# Altium schematic sheet Teensy4-CANTool-Rev3.SchDoc: Teensy 4.1 CAN Tool
size Letter portrait; Author: Dr. Jeremy Daily; Organization: Systems Cyber Research Group; Address1: Systems Engineering; Address2: Colorado State University; Address3: Fort Collins, CO 80523; Address4: www.engr.colostate.edu/se/; DocumentNumber: Vehicle Communications; Revision: 3; SheetNumber: 1; SheetTotal: 1
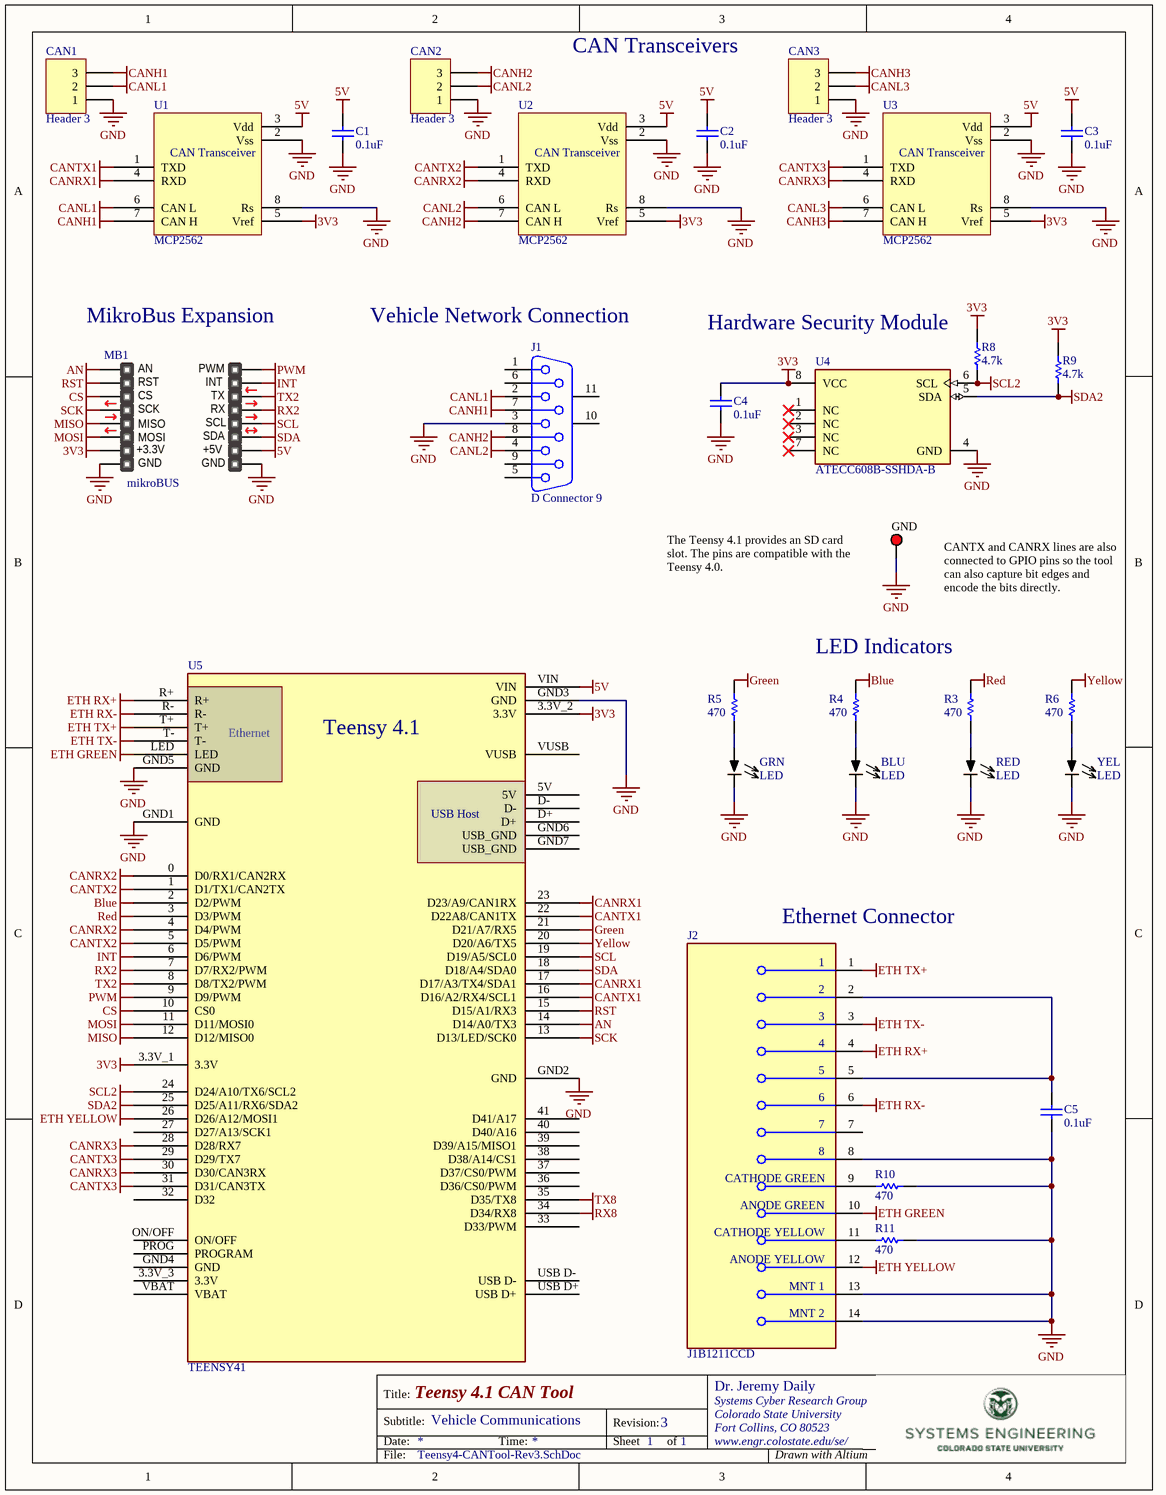
[diagram p0: Teensy4-CANTool-Rev3.SchDoc]

## Parts
BLU  LED  [LED - 5mm Through Hole]
C1  0.1uF  [CAPR5-4X5]
C2  0.1uF  [CAPR5-4X5]
C3  0.1uF  [CAPR5-4X5]
C4  0.1uF  [CAPR5-4X5]
C5  0.1uF  [CAPR5-4X5]
CAN1  Header 3  [PCB Terminal Block - 3]
CAN2  Header 3  [PCB Terminal Block - 3]
CAN3  Header 3  [PCB Terminal Block - 3]
GND  5010  [KSTN-5010_V]  (value not drawn)
GRN  LED  [LED - 5mm Through Hole]
J1  D Connector 9  [DSUB1.385-2H9]
J2  J1B1211CCD  [FP-J1B1211CCD-MFG]
MB1  mikroBUS  [mikroBUS - Midi]  (no BOM)
R3  470  [AXIAL-0.4]
R4  470  [AXIAL-0.4]
R5  470  [AXIAL-0.4]
R6  470  [AXIAL-0.4]
R8  4.7k  [RESA60-630X240]
R9  4.7k  [RESA60-630X240]
R10  470  [AXIAL-0.4]
R11  470  [axial-0.4]
RED  LED  [LED - 5mm Through Hole]
U1  MCP2562  [DIP8]
U2  MCP2562  [DIP8]
U3  MCP2562  [DIP8]
U4  ATECC608B-SSHDA-B  [FP-C04-057-SWB-IPC_C]
U5  TEENSY41  [MODULE_DEV-16771]
YEL  LED  [LED - 5mm Through Hole]

## Nets
3V3: C4.2 MB1.7(3.3V) R8.2 R9.2 U1.5(Vref) U2.5(Vref) U3.5(Vref) U4.8(VCC) U5.3.3V_1(3.3V) U5.3.3V_2(3.3V)
5V: C1.2 C2.2 C3.2 MB1.10(5V) U1.3(Vdd) U2.3(Vdd) U3.3(Vdd) U5.VIN
AN: MB1.1(AN) U5.14(D14/A0/TX3)
Blue: R4.2 U5.2(D2/PWM)
CANH1: CAN1.3 J1.7 U1.7(CAN_H)
CANH2: CAN2.3 J1.8 U2.7(CAN_H)
CANH3: CAN3.3 U3.7(CAN_H)
CANL1: CAN1.2 J1.2 U1.6(CAN_L)
CANL2: CAN2.2 J1.4 U2.6(CAN_L)
CANL3: CAN3.2 U3.6(CAN_L)
CANRX1: U1.4(RXD) U5.17(D17/A3/TX4/SDA1) U5.23(D23/A9/CAN1RX)
CANRX2: U2.4(RXD) U5.0(D0/RX1/CAN2RX) U5.4(D4/PWM)
CANRX3: U3.4(RXD) U5.28(D28/RX7) U5.30(D30/CAN3RX)
CANTX1: U1.1(TXD) U5.16(D16/A2/RX4/SCL1) U5.22(D22A8/CAN1TX)
CANTX2: U2.1(TXD) U5.1(D1/TX1/CAN2TX) U5.5(D5/PWM)
CANTX3: U3.1(TXD) U5.29(D29/TX7) U5.31(D31/CAN3TX)
CS: MB1.3(CS) U5.10(CS0)
ETH GREEN: J2.10(ANODE_GREEN) U5.LED
ETH RX+: J2.4 U5.R+
ETH RX-: J2.6 U5.R-
ETH TX+: J2.1 U5.T+
ETH TX-: J2.3 U5.T-
ETH YELLOW: J2.12(ANODE_YELLOW) U5.26(D26/A12/MOSI1)
GND: BLU.2(C) C1.1 C2.1 C3.1 C4.1 C5.1 CAN1.1 CAN2.1 CAN3.1 GND.1 GRN.2(C) J1.3 J2.8 J2.13(MNT_1) J2.14(MNT_2) MB1.8(GND) MB1.9(GND) R10.1 R11.1 RED.2(C) U1.2(Vss) U1.8(Rs) U2.2(Vss) U2.8(Rs) U3.2(Vss) U3.8(Rs) U4.4(GND) U5.GND1(GND) U5.GND2(GND) U5.GND3(GND) U5.GND5(GND) YEL.2(C)
Green: R5.2 U5.21(D21/A7/RX5)
INT: MB1.15(INT) U5.6(D6/PWM)
MISO: MB1.5(MISO) U5.12(D12/MISO0)
MOSI: MB1.6(MOSI) U5.11(D11/MOSI0)
PWM: MB1.16(PWM) U5.9(D9/PWM)
Red: R3.2 U5.3(D3/PWM)
RST: MB1.2(RST) U5.15(D15/A1/RX3)
RX2: MB1.13(TX) U5.7(D7/RX2/PWM)
RX8: U5.34(D34/RX8)
SCK: MB1.4(SCK) U5.13(D13/LED/SCK0)
SCL: MB1.12(SCL) U5.19(D19/A5/SCL0)
SCL2: R8.1 U4.6(SCL) U5.24(D24/A10/TX6/SCL2)
SDA: MB1.11(SDA) U5.18(D18/A4/SDA0)
SDA2: R9.1 U4.5(SDA) U5.25(D25/A11/RX6/SDA2)
TX2: MB1.14(RX) U5.8(D8/TX2/PWM)
TX8: U5.35(D35/TX8)
Yellow: R6.2 U5.20(D20/A6/TX5)
NetBLU_1: BLU.1(A) R4.1
NetC5_2: C5.2 J2.2 J2.5
NetGRN_1: GRN.1(A) R5.1
NetJ2_9: J2.9(CATHODE_GREEN) R10.2
NetJ2_11: J2.11(CATHODE_YELLOW) R11.2
NetR3_1: R3.1 RED.1(A)
NetR6_1: R6.1 YEL.1(A)

Not connected (* = marked no-connect by the designer): J1 1 5 6 9 10(MH1) 11(MH2); J2 7; U4 1(NC)* 2(NC)* 3(NC)* 7(NC)*; U5 3.3V_3(3.3V) 5V 27(D27/A13/SCK1) 32(D32) 33(D33/PWM) 36(D36/CS0/PWM) 37(D37/CS0/PWM) 38(D38/A14/CS1) 39(D39/A15/MISO1) 40(D40/A16) 41(D41/A17) D+ D- GND4(GND) GND6(USB_GND) GND7(USB_GND) ON/OFF PROG(PROGRAM) USB D+ USB D- VBAT VUSB

## Notes on the sheet
- CAN Transceivers
- (near MB1) MikroBus Expansion
- (near J1) Vehicle Network Connection
- (near R8) Hardware Security Module
- (near GND) The Teensy 4.1 provides an SD card slot. The pins are compatible with the Teensy 4.0.
- (near GND) CANTX and CANRX lines are also connected to GPIO pins so the tool can also capture bit edges and encode the bits directly.
- LED Indicators
- (near J2) Ethernet Connector
- Title:
- Subtitle:
- Date:
- Time:
- Revision:
- Sheet
- of
- File:
- Drawn with Altium
- (in symbol CMP-105-000000-6) Ethernet; USB Host
- (in symbol MCP2551) CAN Transceiver
- (in symbol mikroBUS compatible add-on board) +3.3V; +5V

## Library data of the parts
BLU = LED: Blue 470nm LED Indication - Discrete 3.2V Radial; Manufacturer: Würth Elektronik; PartNumber: 151051BS04000; Supplier 1: Digi-Key; Supplier Part Number 1: 732-5015-ND
C1-C5 = Cap: 0.1µF ±10% 50V Ceramic Capacitor X7R 0603 (1608 Metric); Manufacturer: Vishay Beyschlag/Draloric/BC Components; PartNumber: K104K15X7RF53H5; Supplier 1: Digi-Key; Supplier Part Number 1: BC3323-ND
CAN1-CAN3 = Header 3: Header, 3-Pin; Manufacturer: Phoenix Contact; PartNumber: 1935174; Supplier 1: Digikey; Supplier Part Number 1: 277-1578-ND; Supplier 2: Digikey; Supplier Part Number 2: 1849-1099-ND
GND = CMP-002-00086-1: Interconnection Device; Connector Type: Interconnection Device; RoHS Compliant: Yes
GRN = LED: Green 572nm LED Indication - Discrete 2.1V Radial; Manufacturer: Würth Elektronik; PartNumber: 151051VS04000; Supplier 1: Digi-Key; Supplier Part Number 1: 732-5017-ND
J1 = D Connector 9: CONN D-SUB PLUG 9POS R/A SLDR; Manufacturer: Assmann WSW Components; PartNumber: A-DS 09 A/KG-T2S; Supplier 1: Digi-Key; Supplier Part Number 1: AE10968-ND
J2 = CMP-240752-000001-1: CONN JACK 1PORT 100 BASE-T PCB; Number of Cores per Jack: 4; Direction: Down; Connector Type: RJ45; Shielding: Shielded; Number of Ports: 1; Termination: Solder; Packaging: Bulk; Contact Material: Brass; Color: Green; Number of Rows: 1; Mount: Through Hole; Series: -; Contact Plating: Gold; Max Operating Temperature: 85°C; Min Operating Temperature: -40°C; Housing Material: Thermoplastic
MB1 = mikroBUS compatible add-on board
R3-R6 R10 R11 = Res1: 470 Ohms ±5% 0.25W, 1/4W Through Hole Resistor Axial Carbon Film; Manufacturer: YAGEO; PartNumber: CFR-25JB-52-470R; Supplier 1: Digi-Key; Supplier Part Number 1: 470QBK-ND
R8 R9 = CMP-1659-00063-1: Axial Resistor, 47.5 KOhm, +/- 1%, 0.25 W, -55 to 155 degC, 2-Pin THD, RoHS, Bulk; Tolerance: 20%; Shielding: Shielded; Current Rating: 1.3 A; Case\Package: 1008; ComponentLink1Description: Manufacturer URL; Packaging: Tape and Reel; ComponentLink2Description: Datasheet; Radiation Hardening: No; ComponentLink2URL: http://www.yageo.com/documents/recent/Yageo%20LR_MFR_2013.pdf; Min Operating Temperature: -55 degC; Mount: Surface Mount; Width: 2 mm; Length: 2.5 mm; Max Operating Temperature: 125 degC; PackageReference: MFR-25; Height: 1.2 mm; ComponentLink1URL: http://www.yageo.com/; DatasheetVersion: Apr-13; RoHSCompliant: true; Package Quantity: 3000; Case Code (Metric): 2520; PackageDescription: 2-Pin Axial Lead, Dia 2.4 mm, Body Length 6.3 mm
RED = LED: Red 645nm LED Indication - Discrete 2.1V Radial; Manufacturer: Würth Elektronik; PartNumber: 151051RS11000; Supplier 1: Digi-Key; Supplier Part Number 1: 732-5016-ND
U1-U3 = MCP2551: 1/1 Transceiver CANbus 8-PDIP; Manufacturer: Microchip Technology; PartNumber: MCP2562FD-E/P; Supplier 1: Digi-Key; Supplier Part Number 1: MCP2562FD-E/P-ND
U4 = CMP-06279-000039-1: IC AUTHENTICATION CHIP
U5 = CMP-105-000000-6: PJRC Teensy 4.1 Development Board; Design Item ID: Teensy 4.1
YEL = LED: Yellow 590nm LED Indication - Discrete 2V Radial; Manufacturer: Würth Elektronik; PartNumber: 151051YS04000; Supplier 1: Digi-Key; Supplier Part Number 1: 732-5018-ND